# Altium schematic sheet TOP.SchDoc: Top schematic
size A4; SheetNumber: 3; SheetTotal: 11
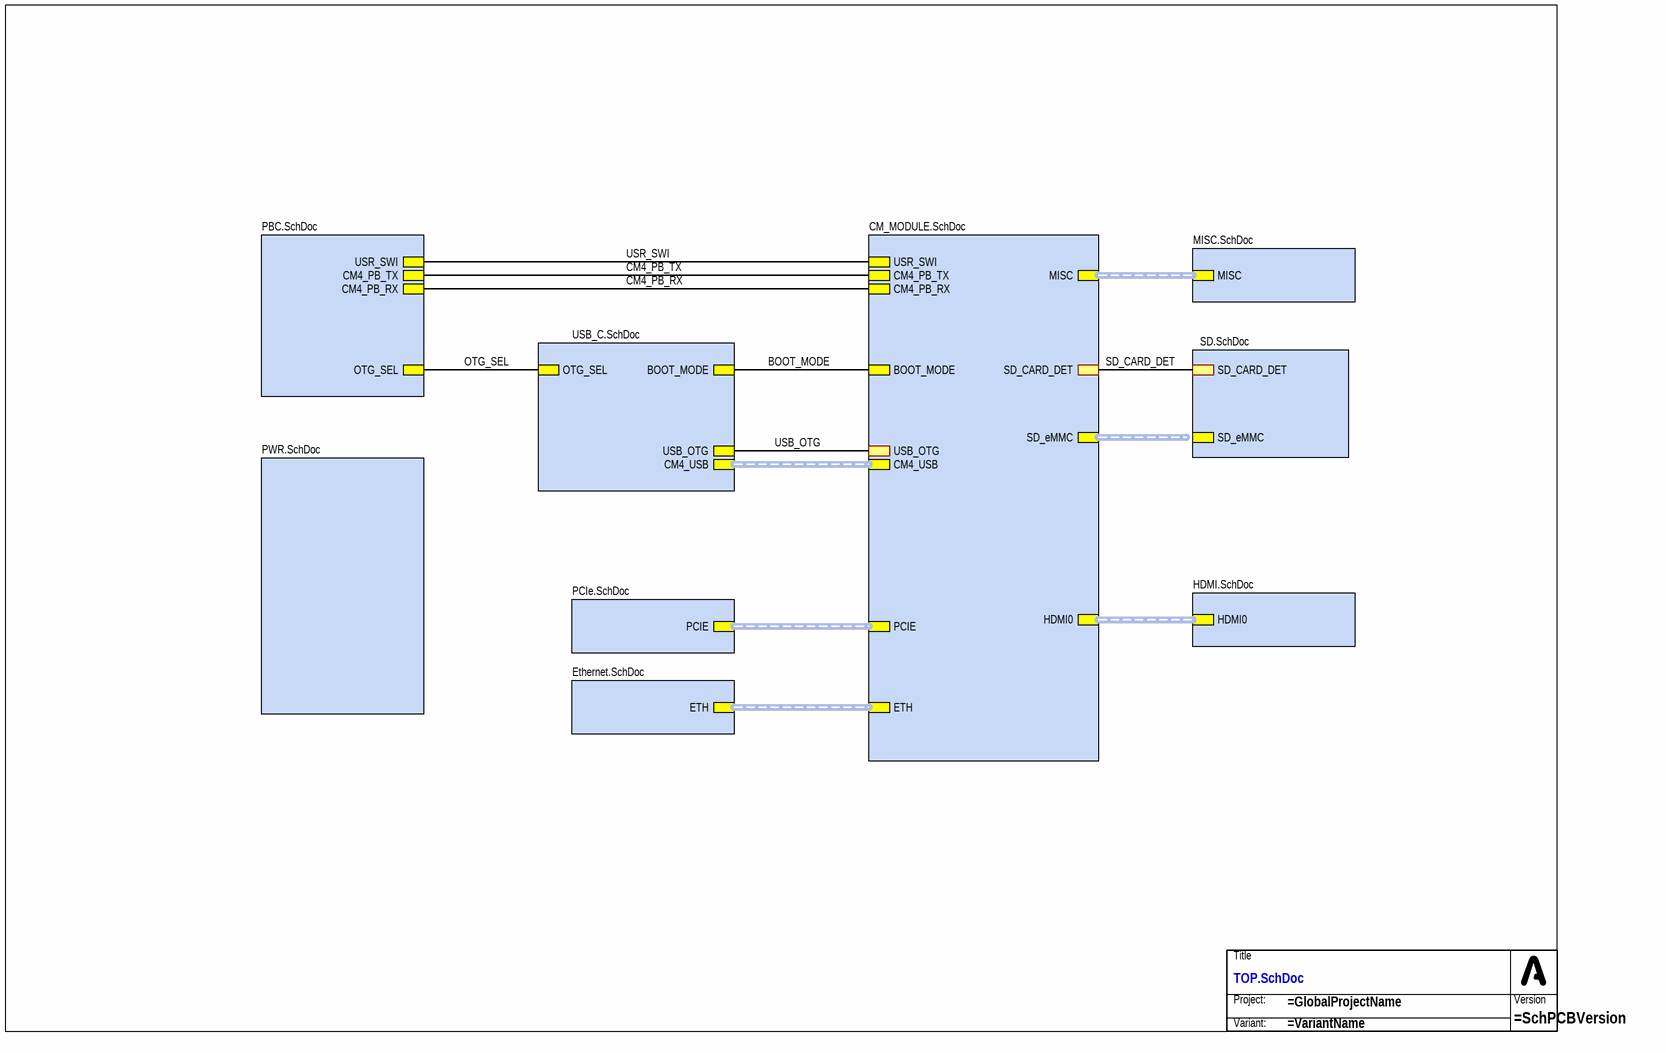
[diagram p0: TOP.SchDoc]

## Parts
TB?  (no value)  (no BOM)

## Sub-sheets
BLK1 = CM_MODULE.SchDoc: BOOT_MODE, MISC (harness MISC), USR_SWI, CM4_PB_TX, CM4_PB_RX, SD_CARD_DET, HDMI0 (harness HDMI), SD_eMMC (harness SD_eMMC), USB_OTG, CM4_USB (harness CM4_USB), PCIE (harness PCIE), ETH (harness ETH)
BLK4 = PCIe.SchDoc: PCIE (harness PCIE)
BLK4 = Ethernet.SchDoc: ETH (harness ETH)
BLK4 = SD.SchDoc: SD_eMMC (harness SD_eMMC), SD_CARD_DET
BLK4 = PWR.SchDoc: no entries
BLK4 = MISC.SchDoc: MISC (harness MISC)
BLK4 = HDMI.SchDoc: HDMI0 (harness HDMI)
BLK4 = PBC.SchDoc: OTG_SEL, USR_SWI, CM4_PB_TX, CM4_PB_RX
BLK5 = USB_C.SchDoc: CM4_USB (harness CM4_USB), BOOT_MODE, USB_OTG, OTG_SEL

## Nets
BOOT_MODE: sheet BLK1/BOOT_MODE, sheet BLK5/BOOT_MODE
CM4_PB_RX: sheet BLK1/CM4_PB_RX, sheet BLK4/CM4_PB_RX
CM4_PB_TX: sheet BLK1/CM4_PB_TX, sheet BLK4/CM4_PB_TX
OTG_SEL: sheet BLK5/OTG_SEL, sheet BLK4/OTG_SEL
SD_CARD_DET: sheet BLK1/SD_CARD_DET, sheet BLK4/SD_CARD_DET
USB_OTG: sheet BLK1/USB_OTG, sheet BLK5/USB_OTG
USR_SWI: sheet BLK1/USR_SWI, sheet BLK4/USR_SWI

## Buses and harness runs
harness sheet BLK1/CM4_USB = sheet BLK5/CM4_USB
harness sheet BLK1/ETH = sheet BLK4/ETH
harness sheet BLK1/HDMI0 = sheet BLK4/HDMI0
harness sheet BLK1/MISC = sheet BLK4/MISC
harness sheet BLK1/PCIE = sheet BLK4/PCIE

## Notes on the sheet
- (in symbol SCH_TITLE_BLOCK_SIMPLE_NODATE) Title; Project:; Version; Variant:

## Library data of the parts
TB? = SCH_TITLE_BLOCK_SIMPLE_NODATE